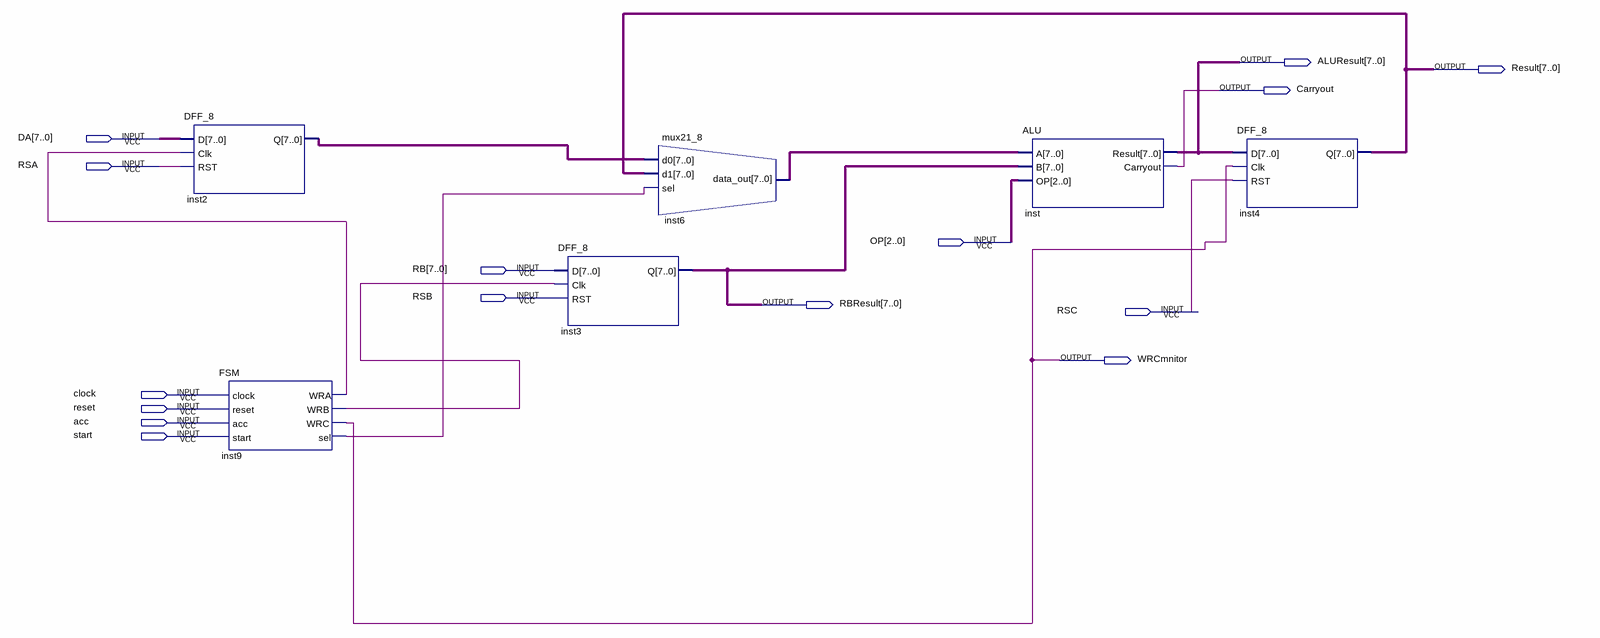
[diagram p0: schematic sheet]
// Quartus schematic alu_controller.bdf as structural Verilog: 6 symbols, 15 pins
module alu_controller (
  input  [7:0] DA,
  input  RSA,
  input  [2:0] OP,
  input  [7:0] RB,
  input  RSB,
  input  RSC,
  input  clock,
  input  reset,
  input  acc,
  input  start,
  output [7:0] ALUResult,
  output [7:0] Result,
  output Carryout,
  output [7:0] RBResult,
  output WRCmnitor
);

  wire inst9_sel, inst9_wra, inst9_wrb;
  wire [7:0] inst2_q, inst6_data_out;

  DFF_8 inst2 (.D(DA), .Clk(inst9_wra), .RST(RSA), .Q(inst2_q));
  FSM inst9 (
    .clock(clock), .reset(reset), .acc(acc), .start(start), .WRA(inst9_wra), .WRB(inst9_wrb),
    .WRC(WRCmnitor), .sel(inst9_sel));
  DFF_8 inst3 (.D(RB), .Clk(inst9_wrb), .RST(RSB), .Q(RBResult));
  mux21_8 inst6 (.d0(inst2_q), .d1(Result), .sel(inst9_sel), .data_out(inst6_data_out));
  ALU inst (.A(inst6_data_out), .B(RBResult), .OP(OP), .Result(ALUResult), .Carryout(Carryout));
  DFF_8 inst4 (.D(ALUResult), .Clk(WRCmnitor), .RST(RSC), .Q(Result));
endmodule
